# EAGLE schematic issue24483_pin_tag (EAGLE 8.2.1)
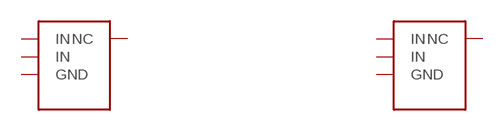
[diagram p0: schematic, sheet 1]

## Parts
U1  MYDEV  [DIP4]
U2  MYDEV_NC  (no package)
Unconnected: U1.1(IN) U1.2(IN) U1.4(NC) U2.GND U2.IN U2.NC

## Power pins joined to a net without a drawn wire
GND: U1.3(GND)

## Library data of the parts
U1 = tagtest:MYDEV
U2 = tagtest:MYDEV_NC